# Altium project Power Driver.PrjPcb
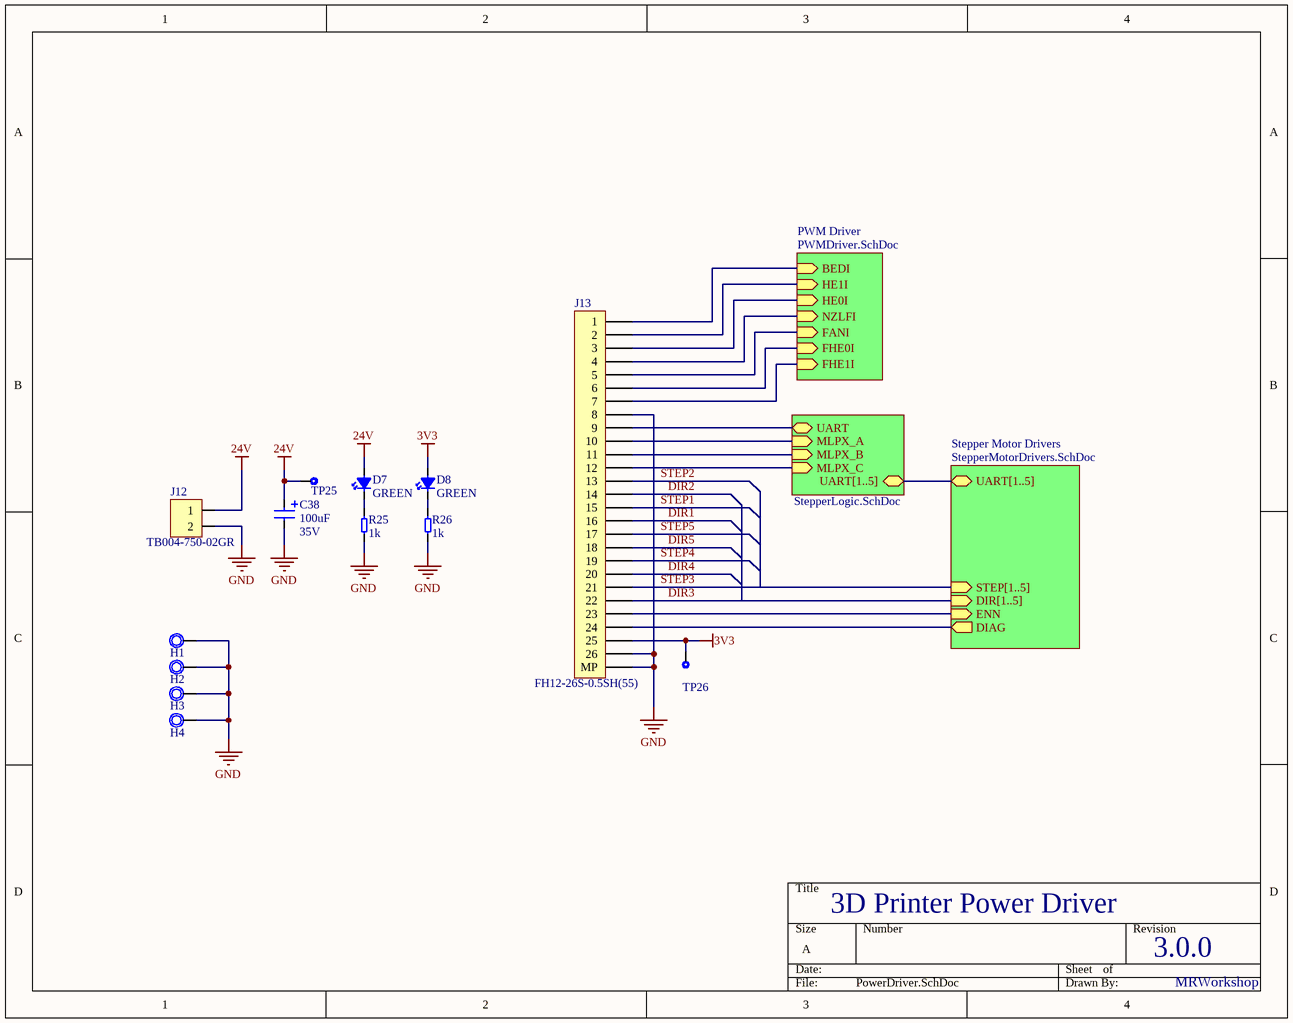
[diagram p0: PowerDriver.SchDoc]
4 sheets, 173 parts. Net scope: hierarchical (ports join the sheet entries above them; power ports are global).
Board file: PCB.PcbDoc
Sheets:
  PowerDriver.SchDoc
    Stepper Motor Drivers = StepperMotorDrivers.SchDoc
    Stepper Logic = StepperLogic.SchDoc
    PWM Driver = PWMDriver.SchDoc

## Sheet PowerDriver.SchDoc: 3D Printer Power Driver
size A; Author: Łukasz Weber

### Parts
C38  value 100uF  Voltage: 35V  [C_8.3x10.5]  (hidden comment: EDT107M035S9MAA)
D7  GREEN  [LED_0402]
D8  GREEN  [LED_0402]
H1  Mounting_Hole_M3  [M3]  (value not drawn)
H2  Mounting_Hole_M3  [M3]  (value not drawn)
H3  Mounting_Hole_M3  [M3]  (value not drawn)
H4  Mounting_Hole_M3  [M3]  (value not drawn)
J12  TB004-750-02GR  [TB004-750-02GR]
J13  FH12-26S-0.5SH(55)  [FH12-26S-0.5SH(55)]
R25  value 1k  [R_0402]  (hidden comment: CR0402-FX-1001GLF)
R26  value 1k  [R_0402]  (hidden comment: CR0402-FX-1001GLF)
TP25  TestPoint_1mm  [TestPoint_1mm]  (value not drawn)
TP26  TestPoint_1mm  [TestPoint_1mm]  (value not drawn)

### Sub-sheets
PWM Driver = PWMDriver.SchDoc: FHE1I (in), HE0I (in), BEDI (in), FANI (in), NZLFI (in), FHE0I (in), HE1I (in)
Stepper Logic = StepperLogic.SchDoc: UART[1..5] (bidir), UART (bidir), MLPX_A (in), MLPX_B (in), MLPX_C (in)
Stepper Motor Drivers = StepperMotorDrivers.SchDoc: STEP[1..5] (in), DIAG (out), UART[1..5] (bidir), DIR[1..5] (in), ENN (in)

### Nets
3V3: D8.2 J13.25 TP26.1
24V: C38.1 D7.2 J12.1 TP25.1
GND: C38.2 H1.1 H2.1 H3.1 H4.1 J12.2 J13.0(MP) J13.8 J13.26 R25.1 R26.1
DIAG: J13.24 ; sheet Stepper Motor Drivers/DIAG
DIR1: J13.16
DIR2: J13.14
DIR3: J13.22
DIR4: J13.20
DIR5: J13.18
ENN: J13.23 ; sheet Stepper Motor Drivers/ENN
MLPX_A: J13.10 ; sheet Stepper Logic/MLPX_A
MLPX_B: J13.11 ; sheet Stepper Logic/MLPX_B
MLPX_C: J13.12 ; sheet Stepper Logic/MLPX_C
STEP1: J13.15
STEP2: J13.13
STEP3: J13.21
STEP4: J13.19
STEP5: J13.17
UART: J13.9 ; sheet Stepper Logic/UART
NetD7_1: D7.1 R25.2
NetD8_1: D8.1 R26.2
NetJ13_1: J13.1 ; sheet PWM Driver/BEDI
NetJ13_2: J13.2 ; sheet PWM Driver/HE1I
NetJ13_3: J13.3 ; sheet PWM Driver/HE0I
NetJ13_4: J13.4 ; sheet PWM Driver/NZLFI
NetJ13_5: J13.5 ; sheet PWM Driver/FANI
NetJ13_6: J13.6 ; sheet PWM Driver/FHE0I
NetJ13_7: J13.7 ; sheet PWM Driver/FHE1I

### Buses and harness runs
bus sheet Stepper Logic/UART[1..5] = sheet Stepper Motor Drivers/UART[1..5]

### Notes on the sheet
- 3D Printer Power Driver
- 3.0.0
- MRWorkshop

### Library data of the parts
C38 = EDT107M035S9MAA: Aluminum Electrolytic Capacitors - SMD 35V 100uF 20% AEC-Q200
D7 D8 = APHHS1005CGCK: Single Colour LEDs GREEN WTR CLEAR 40mcd 574nm; Supplier 1: Digikey; Supplier Part Number 1: 754-1101-1-ND
J12 = TB004-750-02GR: Fixed Terminal Blocks 2 Poles, Screw Type, Horizontal, 7.50 mm Pitch, 24-12 (AWG); Supplier 1: Digikey; Supplier Part Number 1: 2223-TB004-750-02GR-ND
J13 = FH12-26S-0.5SH(55): FFC & FPC Connectors 0.5MM 26 POS R/A BTTM SMT GLD; pin to pad: 0>MP; Supplier 1: Farnell; Supplier Part Number 1: 1324553
R25 R26 = CR0402-FX-1001GLF: Thick Film Resistors - SMD 1.0K OHM 1%; Power: 62.5mW; Supplier 1: Rs; Supplier Part Number 1: 2231667; Tolerance: 1%

## Sheet StepperMotorDrivers.SchDoc
size A3; SPICEModelCacheXNHKODXI: <root> / <DocumentId>XNHKODXI</DocumentId> / </root>
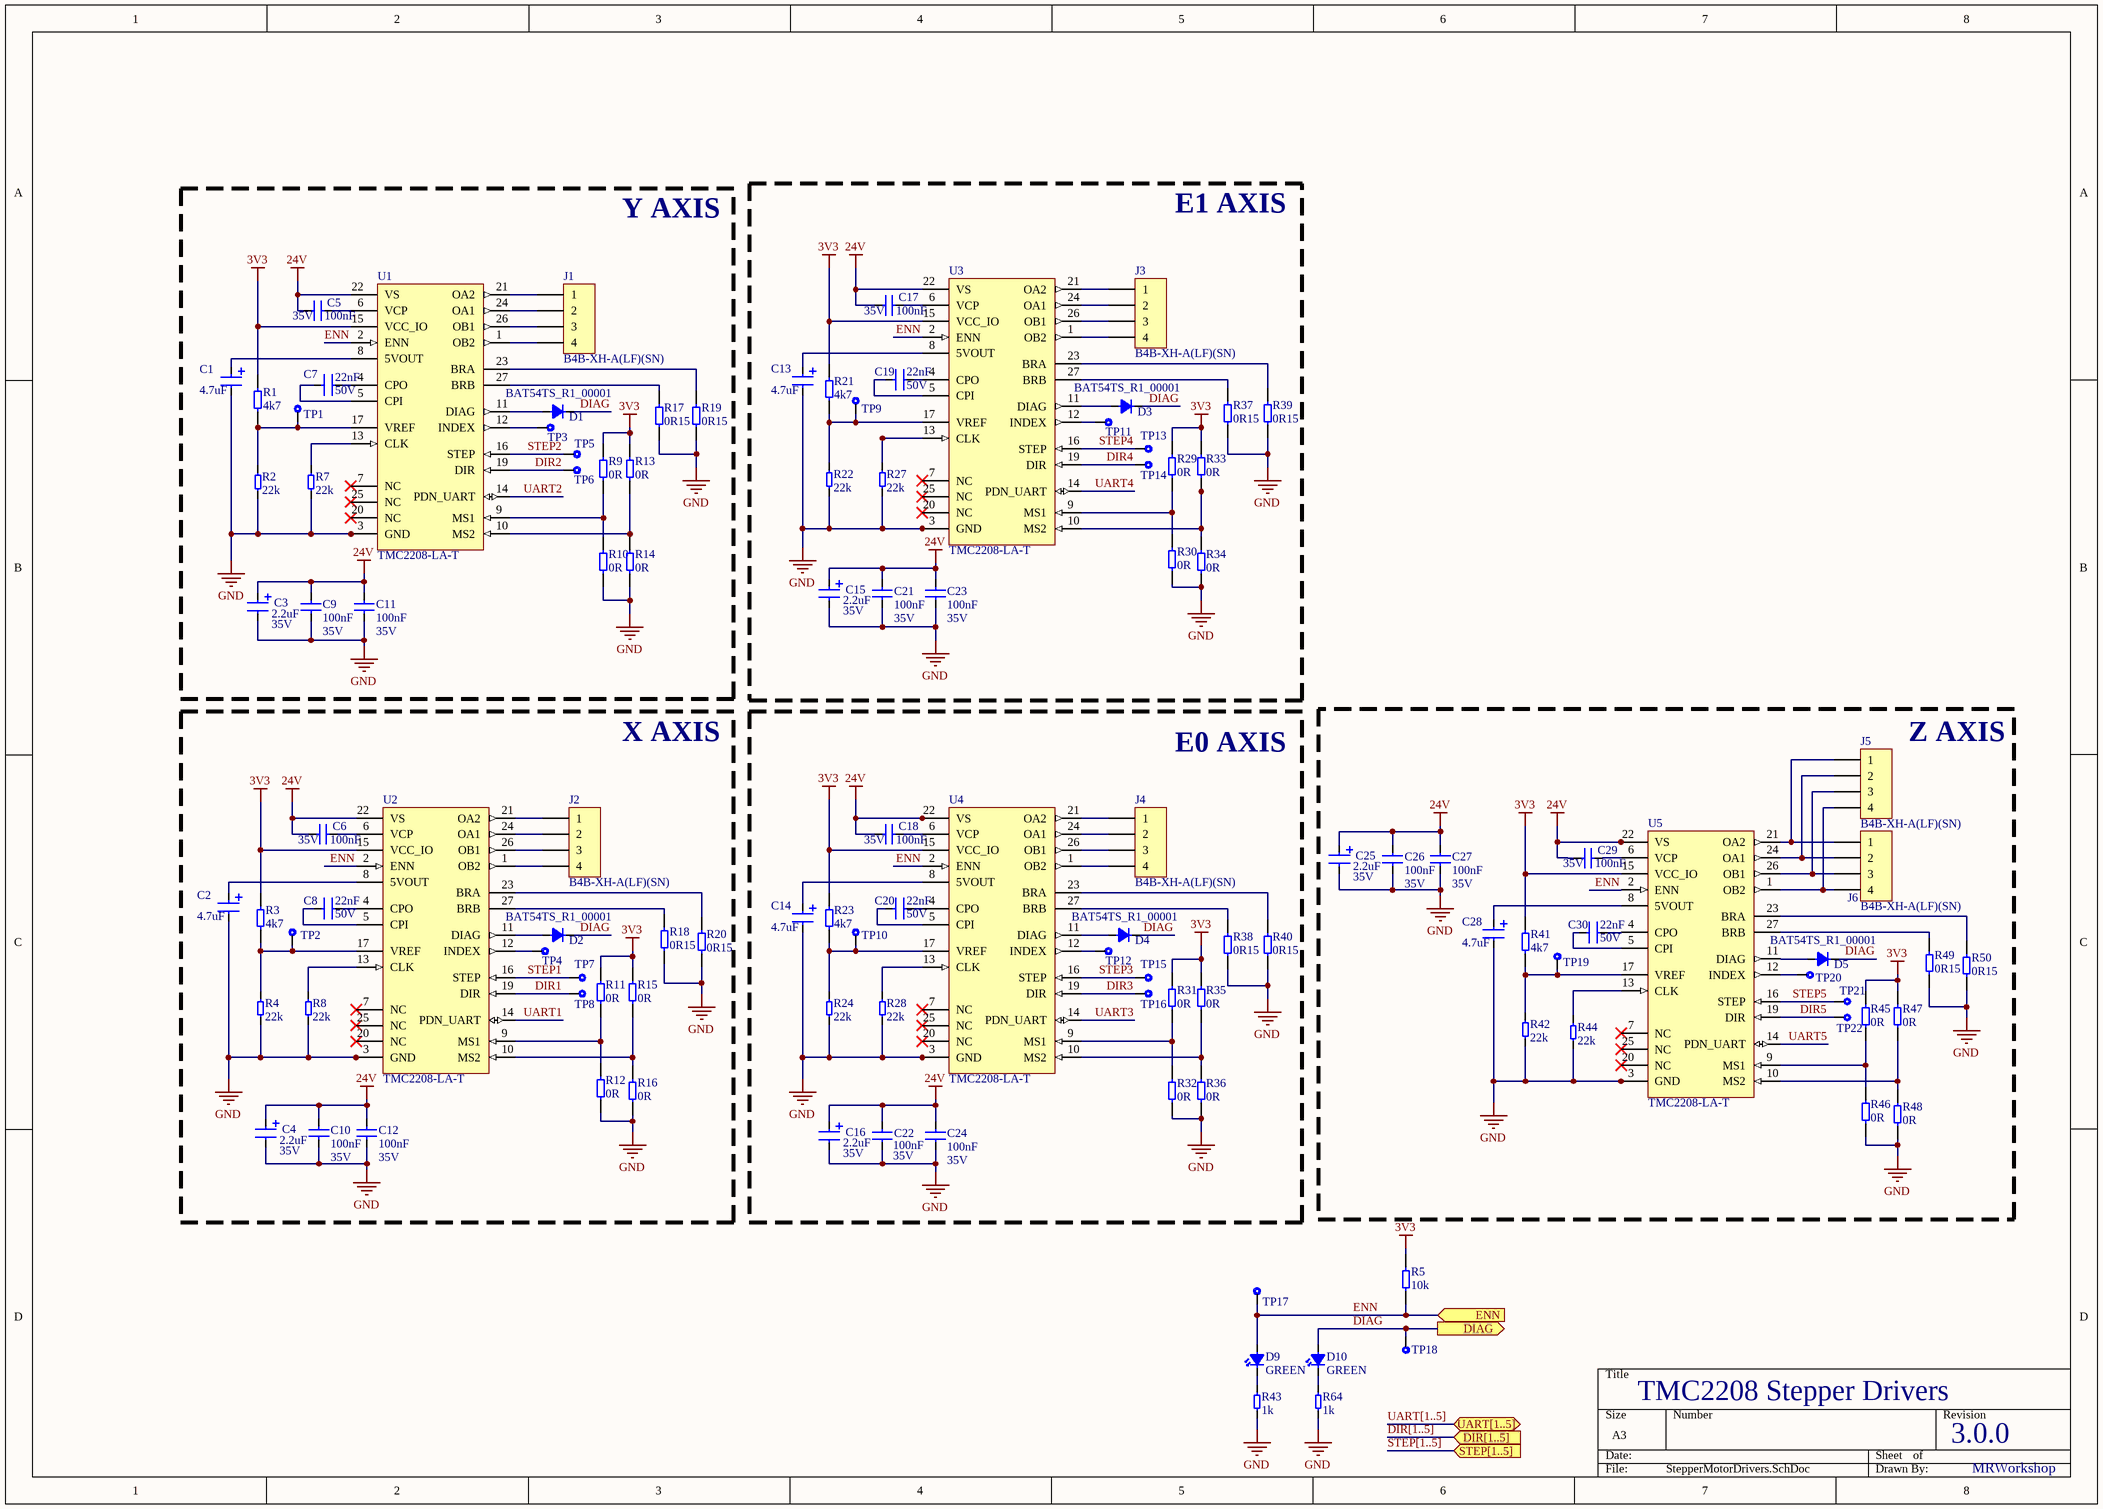
[diagram p1: StepperMotorDrivers.SchDoc]

### Parts
C1  value 4.7uF  [C_0805_Polarized]  (hidden comment: TMCP0J475MTRF)
C2  value 4.7uF  [C_0805_Polarized]  (hidden comment: TMCP0J475MTRF)
C3  value 2.2uF  Voltage: 35V  [C_1206_POLARIZED]  (hidden comment: T491A225M035ATAUTO)
C4  value 2.2uF  Voltage: 35V  [C_1206_POLARIZED]  (hidden comment: T491A225M035ATAUTO)
C5  value 100nF  Voltage: 35V  [C_0402]  (hidden comment: GMK105BJ104KV-F)
C6  value 100nF  Voltage: 35V  [C_0402]  (hidden comment: GMK105BJ104KV-F)
C7  value 22nF  Voltage: 50V  [C_0402]  (hidden comment: MAASU105SB7223KFCA01)
C8  value 22nF  Voltage: 50V  [C_0402]  (hidden comment: MAASU105SB7223KFCA01)
C9  value 100nF  Voltage: 35V  [C_0402]  (hidden comment: GMK105BJ104KV-F)
C10  value 100nF  Voltage: 35V  [C_0402]  (hidden comment: GMK105BJ104KV-F)
C11  value 100nF  Voltage: 35V  [C_0402]  (hidden comment: GMK105BJ104KV-F)
C12  value 100nF  Voltage: 35V  [C_0402]  (hidden comment: GMK105BJ104KV-F)
C13  value 4.7uF  [C_0805_Polarized]  (hidden comment: TMCP0J475MTRF)
C14  value 4.7uF  [C_0805_Polarized]  (hidden comment: TMCP0J475MTRF)
C15  value 2.2uF  Voltage: 35V  [C_1206_POLARIZED]  (hidden comment: T491A225M035ATAUTO)
C16  value 2.2uF  Voltage: 35V  [C_1206_POLARIZED]  (hidden comment: T491A225M035ATAUTO)
C17  value 100nF  Voltage: 35V  [C_0402]  (hidden comment: GMK105BJ104KV-F)
C18  value 100nF  Voltage: 35V  [C_0402]  (hidden comment: GMK105BJ104KV-F)
C19  value 22nF  Voltage: 50V  [C_0402]  (hidden comment: MAASU105SB7223KFCA01)
C20  value 22nF  Voltage: 50V  [C_0402]  (hidden comment: MAASU105SB7223KFCA01)
C21  value 100nF  Voltage: 35V  [C_0402]  (hidden comment: GMK105BJ104KV-F)
C22  value 100nF  Voltage: 35V  [C_0402]  (hidden comment: GMK105BJ104KV-F)
C23  value 100nF  Voltage: 35V  [C_0402]  (hidden comment: GMK105BJ104KV-F)
C24  value 100nF  Voltage: 35V  [C_0402]  (hidden comment: GMK105BJ104KV-F)
C25  value 2.2uF  Voltage: 35V  [C_1206_POLARIZED]  (hidden comment: T491A225M035ATAUTO)
C26  value 100nF  Voltage: 35V  [C_0402]  (hidden comment: GMK105BJ104KV-F)
C27  value 100nF  Voltage: 35V  [C_0402]  (hidden comment: GMK105BJ104KV-F)
C28  value 4.7uF  [C_0805_Polarized]  (hidden comment: TMCP0J475MTRF)
C29  value 100nF  Voltage: 35V  [C_0402]  (hidden comment: GMK105BJ104KV-F)
C30  value 22nF  Voltage: 50V  [C_0402]  (hidden comment: MAASU105SB7223KFCA01)
D1  BAT54TS_R1_00001  [SOD523]
D2  BAT54TS_R1_00001  [SOD523]
D3  BAT54TS_R1_00001  [SOD523]
D4  BAT54TS_R1_00001  [SOD523]
D5  BAT54TS_R1_00001  [SOD523]
D9  GREEN  [LED_0402]
D10  GREEN  [LED_0402]
J1  B4B-XH-A(LF)(SN)  [B4B-XH-A(LF)(SN)]
J2  B4B-XH-A(LF)(SN)  [B4B-XH-A(LF)(SN)]
J3  B4B-XH-A(LF)(SN)  [B4B-XH-A(LF)(SN)]
J4  B4B-XH-A(LF)(SN)  [B4B-XH-A(LF)(SN)]
J5  B4B-XH-A(LF)(SN)  [B4B-XH-A(LF)(SN)]
J6  B4B-XH-A(LF)(SN)  [B4B-XH-A(LF)(SN)]
R1  value 4k7  [R_0402]  (hidden comment: CR0402-FX-4701GLF)
R2  value 22k  [R_0402]  (hidden comment: CR0402-FX-2202GLF)
R3  value 4k7  [R_0402]  (hidden comment: CR0402-FX-4701GLF)
R4  value 22k  [R_0402]  (hidden comment: CR0402-FX-2202GLF)
R5  value 10k  [R_0402]  (hidden comment: CR0402-FX-1002GLF)
R7  value 22k  [R_0402]  (hidden comment: CR0402-FX-2202GLF)
R8  value 22k  [R_0402]  (hidden comment: CR0402-FX-2202GLF)
R9  value 0R  [R_0402]  (hidden comment: CRCW04020000Z0EEHP)
R10  value 0R  [R_0402]  (hidden comment: CRCW04020000Z0EEHP)
R11  value 0R  [R_0402]  (hidden comment: CRCW04020000Z0EEHP)
R12  value 0R  [R_0402]  (hidden comment: CRCW04020000Z0EEHP)
R13  value 0R  [R_0402]  (hidden comment: CRCW04020000Z0EEHP)
R14  value 0R  [R_0402]  (hidden comment: CRCW04020000Z0EEHP)
R15  value 0R  [R_0402]  (hidden comment: CRCW04020000Z0EEHP)
R16  value 0R  [R_0402]  (hidden comment: CRCW04020000Z0EEHP)
R17  value 0R15  [R_1206]  (hidden comment: PT1206FR-7W0R15L)
R18  value 0R15  [R_1206]  (hidden comment: PT1206FR-7W0R15L)
R19  value 0R15  [R_1206]  (hidden comment: PT1206FR-7W0R15L)
R20  value 0R15  [R_1206]  (hidden comment: PT1206FR-7W0R15L)
R21  value 4k7  [R_0402]  (hidden comment: CR0402-FX-4701GLF)
R22  value 22k  [R_0402]  (hidden comment: CR0402-FX-2202GLF)
R23  value 4k7  [R_0402]  (hidden comment: CR0402-FX-4701GLF)
R24  value 22k  [R_0402]  (hidden comment: CR0402-FX-2202GLF)
R27  value 22k  [R_0402]  (hidden comment: CR0402-FX-2202GLF)
R28  value 22k  [R_0402]  (hidden comment: CR0402-FX-2202GLF)
R29  value 0R  [R_0402]  (hidden comment: CRCW04020000Z0EEHP)
R30  value 0R  [R_0402]  (hidden comment: CRCW04020000Z0EEHP)
R31  value 0R  [R_0402]  (hidden comment: CRCW04020000Z0EEHP)
R32  value 0R  [R_0402]  (hidden comment: CRCW04020000Z0EEHP)
R33  value 0R  [R_0402]  (hidden comment: CRCW04020000Z0EEHP)
R34  value 0R  [R_0402]  (hidden comment: CRCW04020000Z0EEHP)
R35  value 0R  [R_0402]  (hidden comment: CRCW04020000Z0EEHP)
R36  value 0R  [R_0402]  (hidden comment: CRCW04020000Z0EEHP)
R37  value 0R15  [R_1206]  (hidden comment: PT1206FR-7W0R15L)
R38  value 0R15  [R_1206]  (hidden comment: PT1206FR-7W0R15L)
R39  value 0R15  [R_1206]  (hidden comment: PT1206FR-7W0R15L)
R40  value 0R15  [R_1206]  (hidden comment: PT1206FR-7W0R15L)
R41  value 4k7  [R_0402]  (hidden comment: CR0402-FX-4701GLF)
R42  value 22k  [R_0402]  (hidden comment: CR0402-FX-2202GLF)
R43  value 1k  [R_0402]  (hidden comment: CR0402-FX-1001GLF)
R44  value 22k  [R_0402]  (hidden comment: CR0402-FX-2202GLF)
R45  value 0R  [R_0402]  (hidden comment: CRCW04020000Z0EEHP)
R46  value 0R  [R_0402]  (hidden comment: CRCW04020000Z0EEHP)
R47  value 0R  [R_0402]  (hidden comment: CRCW04020000Z0EEHP)
R48  value 0R  [R_0402]  (hidden comment: CRCW04020000Z0EEHP)
R49  value 0R15  [R_1206]  (hidden comment: PT1206FR-7W0R15L)
R50  value 0R15  [R_1206]  (hidden comment: PT1206FR-7W0R15L)
R64  value 1k  [R_0402]  (hidden comment: CR0402-FX-1001GLF)
TP1  TestPoint_1mm  [TestPoint_1mm]  (value not drawn)
TP2  TestPoint_1mm  [TestPoint_1mm]  (value not drawn)
TP3  TestPoint_1mm  [TestPoint_1mm]  (value not drawn)
TP4  TestPoint_1mm  [TestPoint_1mm]  (value not drawn)
TP5  TestPoint_1mm  [TestPoint_1mm]  (value not drawn)
TP6  TestPoint_1mm  [TestPoint_1mm]  (value not drawn)
TP7  TestPoint_1mm  [TestPoint_1mm]  (value not drawn)
TP8  TestPoint_1mm  [TestPoint_1mm]  (value not drawn)
TP9  TestPoint_1mm  [TestPoint_1mm]  (value not drawn)
TP10  TestPoint_1mm  [TestPoint_1mm]  (value not drawn)
TP11  TestPoint_1mm  [TestPoint_1mm]  (value not drawn)
TP12  TestPoint_1mm  [TestPoint_1mm]  (value not drawn)
TP13  TestPoint_1mm  [TestPoint_1mm]  (value not drawn)
TP14  TestPoint_1mm  [TestPoint_1mm]  (value not drawn)
TP15  TestPoint_1mm  [TestPoint_1mm]  (value not drawn)
TP16  TestPoint_1mm  [TestPoint_1mm]  (value not drawn)
TP17  TestPoint_1mm  [TestPoint_1mm]  (value not drawn)
TP18  TestPoint_1mm  [TestPoint_1mm]  (value not drawn)
TP19  TestPoint_1mm  [TestPoint_1mm]  (value not drawn)
TP20  TestPoint_1mm  [TestPoint_1mm]  (value not drawn)
TP21  TestPoint_1mm  [TestPoint_1mm]  (value not drawn)
TP22  TestPoint_1mm  [TestPoint_1mm]  (value not drawn)
U1  TMC2208-LA-T  [QFN28]
U2  TMC2208-LA-T  [QFN28]
U3  TMC2208-LA-T  [QFN28]
U4  TMC2208-LA-T  [QFN28]
U5  TMC2208-LA-T  [QFN28]

### Blocks framed on the sheet
Y AXIS: C1 C3 C5 C7 C9 C11 D1 J1 R1 R2 R7 R9 R10 R13 R14 R17 R19 TP1 TP3 TP5 TP6 U1
E1 AXIS: C13 C15 C17 C19 C21 C23 D3 J3 R21 R22 R27 R29 R30 R33 R34 R37 R39 TP9 TP11 TP13 TP14 U3
X AXIS: C2 C4 C6 C8 C10 C12 D2 J2 R3 R4 R8 R11 R12 R15 R16 R18 R20 TP2 TP4 TP7 TP8 U2
E0 AXIS: C14 C16 C18 C20 C22 C24 D4 J4 R23 R24 R28 R31 R32 R35 R36 R38 R40 TP10 TP12 TP15 TP16 U4
Z AXIS: C25-C30 D5 J5 J6 R41 R42 R44-R50 TP19-TP22 U5

### Ports
DIAG (out), DIR[1..5] (in), ENN (in), STEP[1..5] (in), UART[1..5] (bidir)

### Nets
3V3: R1.2 R3.2 R5.2 R9.2 R11.2 R13.2 R15.2 R21.2 R23.2 R29.2 R31.2 R33.2 R35.2 R41.2 R45.2 R47.2 U1.15(VCC_IO) U2.15(VCC_IO) U3.15(VCC_IO) U4.15(VCC_IO) U5.15(VCC_IO)
24V: C3.1 C4.1 C5.1 C6.1 C9.2 C10.2 C11.2 C12.2 C15.1 C16.1 C17.1 C18.1 C21.2 C22.2 C23.2 C24.2 C25.1 C26.2 C27.2 C29.1 U1.22(VS) U1.28(VS) U2.22(VS) U2.28(VS) U3.22(VS) U3.28(VS) U4.22(VS) U4.28(VS) U5.22(VS) U5.28(VS)
GND: C1.2 C2.2 C3.2 C4.2 C9.1 C10.1 C11.1 C12.1 C13.2 C14.2 C15.2 C16.2 C21.1 C22.1 C23.1 C24.1 C25.2 C26.1 C27.1 C28.2 R2.1 R4.1 R7.1 R8.1 R10.1 R12.1 R14.1 R16.1 R17.1 R18.1 R19.1 R20.1 R22.1 R24.1 R27.1 R28.1 R30.1 R32.1 R34.1 R36.1 R37.1 R38.1 R39.1 R40.1 R42.1 R43.1 R44.1 R46.1 R48.1 R49.1 R50.1 R64.1 U1.3(GND) U1.18(GND) U1.29(GND) U2.3(GND) U2.18(GND) U2.29(GND) U3.3(GND) U3.18(GND) U3.29(GND) U4.3(GND) U4.18(GND) U4.29(GND) U5.3(GND) U5.18(GND) U5.29(GND)
DIAG: D1.1 D2.1 D3.1 D4.1 D5.1 D10.2 TP18.1 ; port DIAG
DIR1: TP8.1 U2.19(DIR)
DIR2: TP6.1 U1.19(DIR)
DIR3: TP16.1 U4.19(DIR)
DIR4: TP14.1 U3.19(DIR)
DIR5: TP22.1 U5.19(DIR)
ENN: D9.2 R5.1 TP17.1 U1.2(ENN) U2.2(ENN) U3.2(ENN) U4.2(ENN) U5.2(ENN) ; port ENN
STEP1: TP7.1 U2.16(STEP)
STEP2: TP5.1 U1.16(STEP)
STEP3: TP15.1 U4.16(STEP)
STEP4: TP13.1 U3.16(STEP)
STEP5: TP21.1 U5.16(STEP)
UART1: U2.14(PDN_UART)
UART2: U1.14(PDN_UART)
UART3: U4.14(PDN_UART)
UART4: U3.14(PDN_UART)
UART5: U5.14(PDN_UART)
NetC1_1: C1.1 U1.8(5VOUT)
NetC2_1: C2.1 U2.8(5VOUT)
NetC5_2: C5.2 U1.6(VCP)
NetC6_2: C6.2 U2.6(VCP)
NetC7_1: C7.1 U1.5(CPI)
NetC7_2: C7.2 U1.4(CPO)
NetC8_1: C8.1 U2.5(CPI)
NetC8_2: C8.2 U2.4(CPO)
NetC13_1: C13.1 U3.8(5VOUT)
NetC14_1: C14.1 U4.8(5VOUT)
NetC17_2: C17.2 U3.6(VCP)
NetC18_2: C18.2 U4.6(VCP)
NetC19_1: C19.1 U3.5(CPI)
NetC19_2: C19.2 U3.4(CPO)
NetC20_1: C20.1 U4.5(CPI)
NetC20_2: C20.2 U4.4(CPO)
NetC28_1: C28.1 U5.8(5VOUT)
NetC29_2: C29.2 U5.6(VCP)
NetC30_1: C30.1 U5.5(CPI)
NetC30_2: C30.2 U5.4(CPO)
NetD1_2: D1.2 U1.11(DIAG)
NetD2_2: D2.2 U2.11(DIAG)
NetD3_2: D3.2 U3.11(DIAG)
NetD4_2: D4.2 U4.11(DIAG)
NetD5_2: D5.2 U5.11(DIAG)
NetD9_1: D9.1 R43.2
NetD10_1: D10.1 R64.2
NetJ1_1: J1.1 U1.21(OA2)
NetJ1_2: J1.2 U1.24(OA1)
NetJ1_3: J1.3 U1.26(OB1)
NetJ1_4: J1.4 U1.1(OB2)
NetJ2_1: J2.1 U2.21(OA2)
NetJ2_2: J2.2 U2.24(OA1)
NetJ2_3: J2.3 U2.26(OB1)
NetJ2_4: J2.4 U2.1(OB2)
NetJ3_1: J3.1 U3.21(OA2)
NetJ3_2: J3.2 U3.24(OA1)
NetJ3_3: J3.3 U3.26(OB1)
NetJ3_4: J3.4 U3.1(OB2)
NetJ4_1: J4.1 U4.21(OA2)
NetJ4_2: J4.2 U4.24(OA1)
NetJ4_3: J4.3 U4.26(OB1)
NetJ4_4: J4.4 U4.1(OB2)
NetJ5_1: J5.1 J6.1 U5.21(OA2)
NetJ5_2: J5.2 J6.2 U5.24(OA1)
NetJ5_3: J5.3 J6.3 U5.26(OB1)
NetJ5_4: J5.4 J6.4 U5.1(OB2)
NetR1_1: R1.1 R2.2 TP1.1 U1.17(VREF)
NetR3_1: R3.1 R4.2 TP2.1 U2.17(VREF)
NetR7_2: R7.2 U1.13(CLK)
NetR8_2: R8.2 U2.13(CLK)
NetR9_1: R9.1 R10.2 U1.9(MS1)
NetR11_1: R11.1 R12.2 U2.9(MS1)
NetR13_1: R13.1 R14.2 U1.10(MS2)
NetR15_1: R15.1 R16.2 U2.10(MS2)
NetR17_2: R17.2 U1.27(BRB)
NetR18_2: R18.2 U2.27(BRB)
NetR19_2: R19.2 U1.23(BRA)
NetR20_2: R20.2 U2.23(BRA)
NetR21_1: R21.1 R22.2 TP9.1 U3.17(VREF)
NetR23_1: R23.1 R24.2 TP10.1 U4.17(VREF)
NetR27_2: R27.2 U3.13(CLK)
NetR28_2: R28.2 U4.13(CLK)
NetR29_1: R29.1 R30.2 U3.9(MS1)
NetR31_1: R31.1 R32.2 U4.9(MS1)
NetR33_1: R33.1 R34.2 U3.10(MS2)
NetR35_1: R35.1 R36.2 U4.10(MS2)
NetR37_2: R37.2 U3.27(BRB)
NetR38_2: R38.2 U4.27(BRB)
NetR39_2: R39.2 U3.23(BRA)
NetR40_2: R40.2 U4.23(BRA)
NetR41_1: R41.1 R42.2 TP19.1 U5.17(VREF)
NetR44_2: R44.2 U5.13(CLK)
NetR45_1: R45.1 R46.2 U5.9(MS1)
NetR47_1: R47.1 R48.2 U5.10(MS2)
NetR49_2: R49.2 U5.27(BRB)
NetR50_2: R50.2 U5.23(BRA)
NetTP3_1: TP3.1 U1.12(INDEX)
NetTP4_1: TP4.1 U2.12(INDEX)
NetTP11_1: TP11.1 U3.12(INDEX)
NetTP12_1: TP12.1 U4.12(INDEX)
NetTP20_1: TP20.1 U5.12(INDEX)

Not connected (* = marked no-connect by the designer): U1 7(NC)* 20(NC)* 25(NC)*; U2 7(NC)* 20(NC)* 25(NC)*; U3 7(NC)* 20(NC)* 25(NC)*; U4 7(NC)* 20(NC)* 25(NC)*; U5 7(NC)* 20(NC)* 25(NC)*

### Buses and harness runs
bus DIR[1..5] = port DIR[1..5]
bus STEP[1..5] = port STEP[1..5]
bus UART[1..5] = port UART[1..5]

### Notes on the sheet
- TMC2208 Stepper Drivers
- 3.0.0
- MRWorkshop

### Library data of the parts
C1 C2 C13 C14 C28 = TMCP0J475MTRF: Tantalum Capacitors - Solid SMD 7volts 4.7uF 20% Molded Case, 0805; Voltage: 6.3V; Supplier 1: Mouser; Supplier Part Number 1: 74-TMCP0J475MTRF; Tolerance: 20%
C3 C4 C15 C16 C25 = T491A225M035ATAUTO: Tantalum Capacitors - Solid SMD 35V 2.2uF 1206 20% ESR=45mOhms AECQ200; Supplier 1: Mouser; Supplier Part Number 1: 80-T491A225M35ATAUTO
C5 C6 C9-C12 C17 C18 C21-C24 C26 C27 C29 = GMK105BJ104KV-F: Multilayer Ceramic Capacitors MLCC - SMD/SMT 963-MSASG105SB5104KF RPLCMT PN 35V 0.1uF X5R 0402 10%; Supplier 1: Digikey; Supplier Part Number 1: 587-1994-1-ND
C7 C8 C19 C20 C30 = MAASU105SB7223KFCA01: Multilayer Ceramic Capacitors MLCC - SMD/SMT 50V 0.022uF X7R 0402 10% AEC-Q200; Supplier 1: Farnell; Supplier Part Number 1: 4133232
D1-D5 = BAT54TS_R1_00001: Schottky Diodes & Rectifiers 30V,Schottky,SOD-523,0.2A; Supplier 1: Digikey; Supplier Part Number 1: 3757-BAT54TS_R1_00001CT-ND
D9 D10 = APHHS1005CGCK: as D7 on sheet PowerDriver; Supplier 1: Digikey; Supplier Part Number 1: 754-1101-1-ND
J1-J6 = B4B-XH-A(LF)(SN): Headers & Wire Housings XH HEADER (TOP); Supplier 1: Rs; Supplier Part Number 1: 8201551P
R1 R3 R21 R23 R41 = CR0402-FX-4701GLF: Thick Film Resistors - SMD 4.7K OHM 1%; Supplier 1: Farnell; Supplier Part Number 1: 4014423
R2 R4 R7 R8 R22 R24 R27 R28 R42 R44 = CR0402-FX-2202GLF: Thick Film Resistors - SMD 22K OHM 1%; Power: 62.5mW; Voltage: 50V; Supplier 1: Rs; Supplier Part Number 1: 2477003; Tolerance: 1%
R5 = CR0402-FX-1002GLF: Thick Film Resistors - SMD 10K OHM 1%; Supplier 1: Farnell; Supplier Part Number 1: 2333566
R9-R16 R29-R36 R45-R48 = CRCW04020000Z0EEHP: Thick Film Resistors - SMD CRCW 402 jumper; Supplier 1: Mouser; Supplier Part Number 1: 71-CRCW04020000Z0EEH
R17-R20 R37-R40 R49 R50 = PT1206FR-7W0R15L: Current Sense Resistors - SMD 150 mOhms 500mW 1 % 75 ppm/C AEC-Q200; Power: 0.5W; Supplier 1: Digikey; Supplier Part Number 1: 13-PT1206FR-7W0R15LCT-ND
R43 R64 = CR0402-FX-1001GLF: as R25 on sheet PowerDriver; Supplier 1: Rs; Supplier Part Number 1: 2231667; Tolerance: 1%
U1-U5 = TMC2208-LA-T: Motor/Motion/Ignition Controllers & Drivers Silent stepper motor driver 5 to 36V, up to 1.4A with S/D and UART Interface, 256 Steps, SpreadCycle and Stealthchop; Supplier 1: Mouser; Supplier Part Number 1: 700-TMC2208-LA-T

## Sheet StepperLogic.SchDoc
size A4
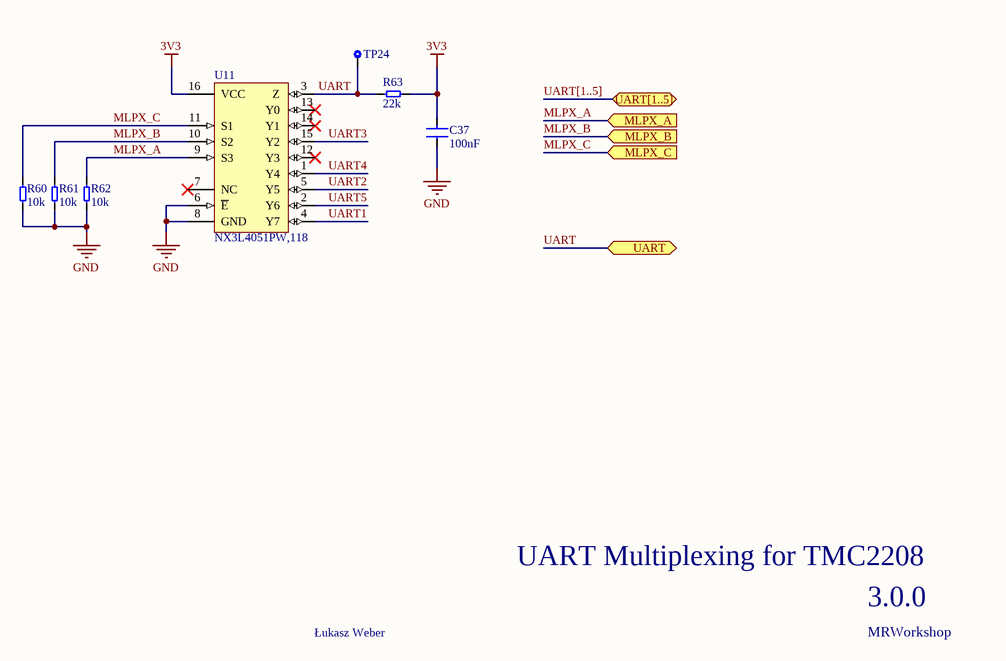
[diagram p2: StepperLogic.SchDoc]

### Parts
C37  value 100nF  [C_0402]  (hidden comment: GRM155R61A104KA01J)
R60  value 10k  [R_0402]  (hidden comment: CR0402-FX-1002GLF)
R61  value 10k  [R_0402]  (hidden comment: CR0402-FX-1002GLF)
R62  value 10k  [R_0402]  (hidden comment: CR0402-FX-1002GLF)
R63  value 22k  [R_0402]  (hidden comment: CR0402-FX-2202GLF)
TP24  TestPoint_1mm  [TestPoint_1mm]  (value not drawn)
U11  NX3L4051PW,118  [TSSOP16]

### Ports
MLPX_A (in), MLPX_B (in), MLPX_C (in), UART (bidir), UART[1..5] (bidir)

### Nets
3V3: C37.2 R63.1 U11.16(VCC)
GND: C37.1 R60.1 R61.1 R62.1 U11.6(~{E}) U11.8(GND)
MLPX_A: R62.2 U11.9(S3) ; port MLPX_A
MLPX_B: R61.2 U11.10(S2) ; port MLPX_B
MLPX_C: R60.2 U11.11(S1) ; port MLPX_C
UART: R63.2 TP24.1 U11.3(Z) ; port UART
UART1: U11.4(Y7)
UART2: U11.5(Y5)
UART3: U11.15(Y2)
UART4: U11.1(Y4)
UART5: U11.2(Y6)

Not connected (* = marked no-connect by the designer): U11 7(NC)* 12(Y3)* 13(Y0)* 14(Y1)*

### Buses and harness runs
bus UART[1..5] = port UART[1..5]

### Notes on the sheet
- UART Multiplexing for TMC2208
- 3.0.0
- Łukasz Weber
- MRWorkshop

### Library data of the parts
C37 = GRM155R61A104KA01J: Multilayer Ceramic Capacitors MLCC - SMD/SMT 0.1 uF 10 VDC 10% 0402 X5R; Voltage: 10V; Supplier 1: Mouser; Supplier Part Number 1: 81-GRM15R61A104KA01J; Tolerance: 10%
R60-R62 = CR0402-FX-1002GLF: Thick Film Resistors - SMD 10K OHM 1%; Supplier 1: Farnell; Supplier Part Number 1: 2333566
R63 = CR0402-FX-2202GLF: as R2 on sheet StepperMotorDrivers; Supplier 1: Rs; Supplier Part Number 1: 2477003; Tolerance: 1%
U11 = NX3L4051PW,118: Analogue Switch ICs ANLG SWT SPST 3.3V; Supplier 1: Farnell; Supplier Part Number 1: 2775927

## Sheet PWMDriver.SchDoc
size A4; SPICEModelCacheEKQLMBQO: <root> / <DocumentId>EKQLMBQO</DocumentId> / </root>
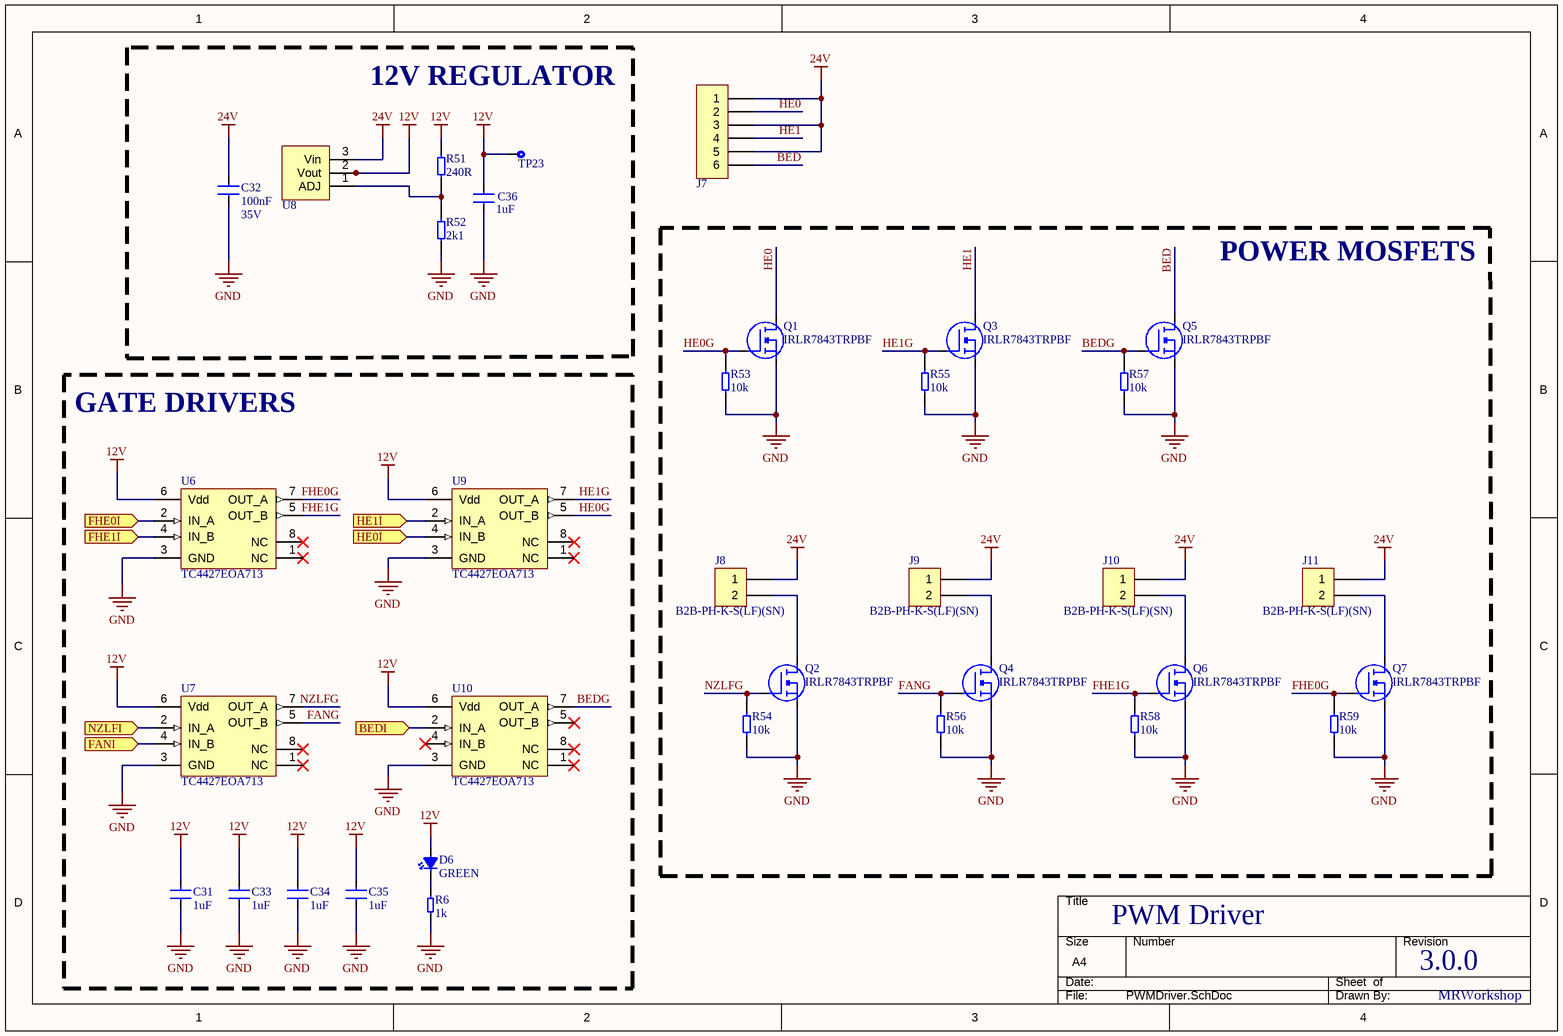
[diagram p3: PWMDriver.SchDoc]

### Parts
C31  value 1uF  [C_0402]  (hidden comment: TMK105BJ105MV-F)
C32  value 100nF  Voltage: 35V  [C_0402]  (hidden comment: GMK105BJ104KV-F)
C33  value 1uF  [C_0402]  (hidden comment: TMK105BJ105MV-F)
C34  value 1uF  [C_0402]  (hidden comment: TMK105BJ105MV-F)
C35  value 1uF  [C_0402]  (hidden comment: TMK105BJ105MV-F)
C36  value 1uF  [C_0402]  (hidden comment: TMK105BJ105MV-F)
D6  GREEN  [LED_0402]
J7  TB004-750-06GR  [TB004-750-06GR]  (value not drawn)
J8  B2B-PH-K-S(LF)(SN)  [B2B-PH-K-S(LF)(SN)]
J9  B2B-PH-K-S(LF)(SN)  [B2B-PH-K-S(LF)(SN)]
J10  B2B-PH-K-S(LF)(SN)  [B2B-PH-K-S(LF)(SN)]
J11  B2B-PH-K-S(LF)(SN)  [B2B-PH-K-S(LF)(SN)]
Q1  IRLR7843TRPBF  [DPAK-6.2x6.7]
Q2  IRLR7843TRPBF  [DPAK-6.2x6.7]
Q3  IRLR7843TRPBF  [DPAK-6.2x6.7]
Q4  IRLR7843TRPBF  [DPAK-6.2x6.7]
Q5  IRLR7843TRPBF  [DPAK-6.2x6.7]
Q6  IRLR7843TRPBF  [DPAK-6.2x6.7]
Q7  IRLR7843TRPBF  [DPAK-6.2x6.7]
R6  value 1k  [R_0402]  (hidden comment: CR0402-FX-1001GLF)
R51  value 240R  [R_0402]  (hidden comment: CR0402-FX-2400GLF)
R52  value 2k1  [R_0402]  (hidden comment: CR0402-FX-2101GLF)
R53  value 10k  [R_0402]  (hidden comment: CR0402-FX-1002GLF)
R54  value 10k  [R_0402]  (hidden comment: CR0402-FX-1002GLF)
R55  value 10k  [R_0402]  (hidden comment: CR0402-FX-1002GLF)
R56  value 10k  [R_0402]  (hidden comment: CR0402-FX-1002GLF)
R57  value 10k  [R_0402]  (hidden comment: CR0402-FX-1002GLF)
R58  value 10k  [R_0402]  (hidden comment: CR0402-FX-1002GLF)
R59  value 10k  [R_0402]  (hidden comment: CR0402-FX-1002GLF)
TP23  TestPoint_1mm  [TestPoint_1mm]  (value not drawn)
U6  TC4427EOA713  [SOIC8]
U7  TC4427EOA713  [SOIC8]
U8  LM317MBSTT3G  [SOT-223]  (value not drawn)
U9  TC4427EOA713  [SOIC8]
U10  TC4427EOA713  [SOIC8]

### Blocks framed on the sheet
12V REGULATOR: C32 C36 R51 R52 TP23 U8
POWER MOSFETS: J8-J11 Q1-Q7 R53-R59
GATE DRIVERS: C31 C33-C35 D6 R6 U6 U7 U9 U10

### Ports
BEDI (in), FANI (in), FHE0I (in), FHE1I (in), HE0I (in), HE1I (in), NZLFI (in)

### Nets
12V: C31.2 C33.2 C34.2 C35.2 C36.2 D6.2 R51.2 TP23.1 U6.6(Vdd) U7.6(Vdd) U8.2(Vout) U8.4(Vout) U9.6(Vdd) U10.6(Vdd)
24V: C32.2 J7.1 J7.3 J7.5 J8.1 J9.1 J10.1 J11.1 U8.3(Vin)
GND: C31.1 C32.1 C33.1 C34.1 C35.1 C36.1 Q1.3(S) Q2.3(S) Q3.3(S) Q4.3(S) Q5.3(S) Q6.3(S) Q7.3(S) R6.1 R52.1 R53.1 R54.1 R55.1 R56.1 R57.1 R58.1 R59.1 U6.3(GND) U7.3(GND) U9.3(GND) U10.3(GND)
BED: J7.6 Q5.4(D)
BEDG: Q5.1(G) R57.2 U10.7(OUT_A)
FANG: Q4.1(G) R56.2 U7.5(OUT_B)
FHE0G: Q7.1(G) R59.2 U6.7(OUT_A)
FHE1G: Q6.1(G) R58.2 U6.5(OUT_B)
HE0: J7.2 Q1.4(D)
HE0G: Q1.1(G) R53.2 U9.5(OUT_B)
HE1: J7.4 Q3.4(D)
HE1G: Q3.1(G) R55.2 U9.7(OUT_A)
NZLFG: Q2.1(G) R54.2 U7.7(OUT_A)
NetD6_1: D6.1 R6.2
NetJ8_2: J8.2 Q2.4(D)
NetJ9_2: J9.2 Q4.4(D)
NetJ10_2: J10.2 Q6.4(D)
NetJ11_2: J11.2 Q7.4(D)
NetJ13_1: U10.2(IN_A) ; port BEDI
NetJ13_2: U9.2(IN_A) ; port HE1I
NetJ13_3: U9.4(IN_B) ; port HE0I
NetJ13_4: U7.2(IN_A) ; port NZLFI
NetJ13_5: U7.4(IN_B) ; port FANI
NetJ13_6: U6.2(IN_A) ; port FHE0I
NetJ13_7: U6.4(IN_B) ; port FHE1I
NetR51_1: R51.1 R52.2 U8.1(ADJ)

Not connected (* = marked no-connect by the designer): U6 1(NC)* 8(NC)*; U7 1(NC)* 8(NC)*; U9 1(NC)* 8(NC)*; U10 1(NC)* 4(IN_B)* 5(OUT_B)* 8(NC)*

### Notes on the sheet
- PWM Driver
- 3.0.0
- MRWorkshop
- THIS DOCUMENT AND THE DATA DISCLOSED HEREIN OR
- HEREWITH IS THE PROPERTY OF ALTIUM LIMITED AND MAY
- DWG NO:
- REVISION
- REV:
- DESCRIPTION
- DATE
- APPROVED
- BE FREELY DISTRIBUTED IN WHOLE. NO RIGHTS ARE
- RESERVED OR EXPRESS OR IMPLIED WARANTEE GIVEN.
- ENG:
- APPROVALS
- PROJECT
- DSN:
- CHK:
- REFERENCE DOCUMENTS
- PROJECT REVISION:
- TITLE
- DOCUMENT REVISION:
- DESIGN ITEM:
- BOM:
- FAB DWG:
- PCB DWG:
- ASSY DWG:
- SCALE:
- A3
- SIZE
- CAGE CODE
- FILE NAME
- DWG NO.
- SHEET
- OF
- REV

### Library data of the parts
C31 C33-C36 = TMK105BJ105MV-F: Multilayer Ceramic Capacitors MLCC - SMD/SMT 963-MSAST105SB5105MF RPLCMT PN 25V 1uF X5R 0402 20%; Voltage: 25V; Supplier 1: Digikey; Supplier Part Number 1: 587-3245-1-ND
C32 = GMK105BJ104KV-F: as C5 on sheet StepperMotorDrivers; Supplier 1: Digikey; Supplier Part Number 1: 587-1994-1-ND
D6 = APHHS1005CGCK: as D7 on sheet PowerDriver; Supplier 1: Digikey; Supplier Part Number 1: 754-1101-1-ND
J7 = TB004-750-06GR: Fixed Terminal Blocks 6 Poles, Screw Type, Horizontal, 7.50 mm Pitch, 24-12 (AWG)
J8-J11 = B2B-PH-K-S(LF)(SN): Headers & Wire Housings PH SHROUDED HEADER; Supplier 1: Rs; Supplier Part Number 1: 8201422P
Q1-Q7 = IRLR7843TRPBF: MOSFETs 30V 1 N-CH HEXFET 3.3mOhms 34nC; Supplier 1: Farnell; Supplier Part Number 1: 2468059
R6 = CR0402-FX-1001GLF: as R25 on sheet PowerDriver; Supplier 1: Rs; Supplier Part Number 1: 2231667; Tolerance: 1%
R51 = CR0402-FX-2400GLF: Thick Film Resistors - SMD 240 OHM 1%
R52 = CR0402-FX-2101GLF: Thick Film Resistors - SMD 2.1KOHM 1/16WATT 1%; Power: 62.5mW; Supplier 1: Farnell; Supplier Part Number 1: 4059707
R53-R59 = CR0402-FX-1002GLF: Thick Film Resistors - SMD 10K OHM 1%; Supplier 1: Farnell; Supplier Part Number 1: 2333566
U6 U7 U9 U10 = TC4427EOA713: Gate Drivers 1.5A Dual
U8 = LM317MBSTT3G: Linear Voltage Regulators 500mA ADJ 1.2-37V Positive; Supplier 1: Farnell; Supplier Part Number 1: 1652292

## Nets that join several sheets
3V3: PowerDriver (D8.2 J13.25 TP26.1), StepperMotorDrivers (21 pins), StepperLogic (C37.2 R63.1 U11.16)
24V: PowerDriver (C38.1 D7.2 J12.1 TP25.1), StepperMotorDrivers (30 pins), PWMDriver (9 pins)
GND: PowerDriver (11 pins), StepperMotorDrivers (67 pins), StepperLogic (6 pins), PWMDriver (26 pins)
DIAG: PowerDriver (J13.24), StepperMotorDrivers (7 pins)
ENN: PowerDriver (J13.23), StepperMotorDrivers (8 pins)
MLPX_A: PowerDriver (J13.10), StepperLogic (R62.2 U11.9)
MLPX_B: PowerDriver (J13.11), StepperLogic (R61.2 U11.10)
MLPX_C: PowerDriver (J13.12), StepperLogic (R60.2 U11.11)
NetJ13_1: PowerDriver (J13.1), PWMDriver (U10.2)
NetJ13_2: PowerDriver (J13.2), PWMDriver (U9.2)
NetJ13_3: PowerDriver (J13.3), PWMDriver (U9.4)
NetJ13_4: PowerDriver (J13.4), PWMDriver (U7.2)
NetJ13_5: PowerDriver (J13.5), PWMDriver (U7.4)
NetJ13_6: PowerDriver (J13.6), PWMDriver (U6.2)
NetJ13_7: PowerDriver (J13.7), PWMDriver (U6.4)
UART: PowerDriver (J13.9), StepperLogic (R63.2 TP24.1 U11.3)
UART1: StepperMotorDrivers (U2.14), StepperLogic (U11.4)
UART2: StepperMotorDrivers (U1.14), StepperLogic (U11.5)
UART3: StepperMotorDrivers (U4.14), StepperLogic (U11.15)
UART4: StepperMotorDrivers (U3.14), StepperLogic (U11.1)
UART5: StepperMotorDrivers (U5.14), StepperLogic (U11.2)

## Assembly variants
Default: not fitted R? R? R? R? R? R? R? R? R? R?